# Altium schematic sheet Power_Stage.SchDoc
size A4; SheetNumber: 1; SheetTotal: 3
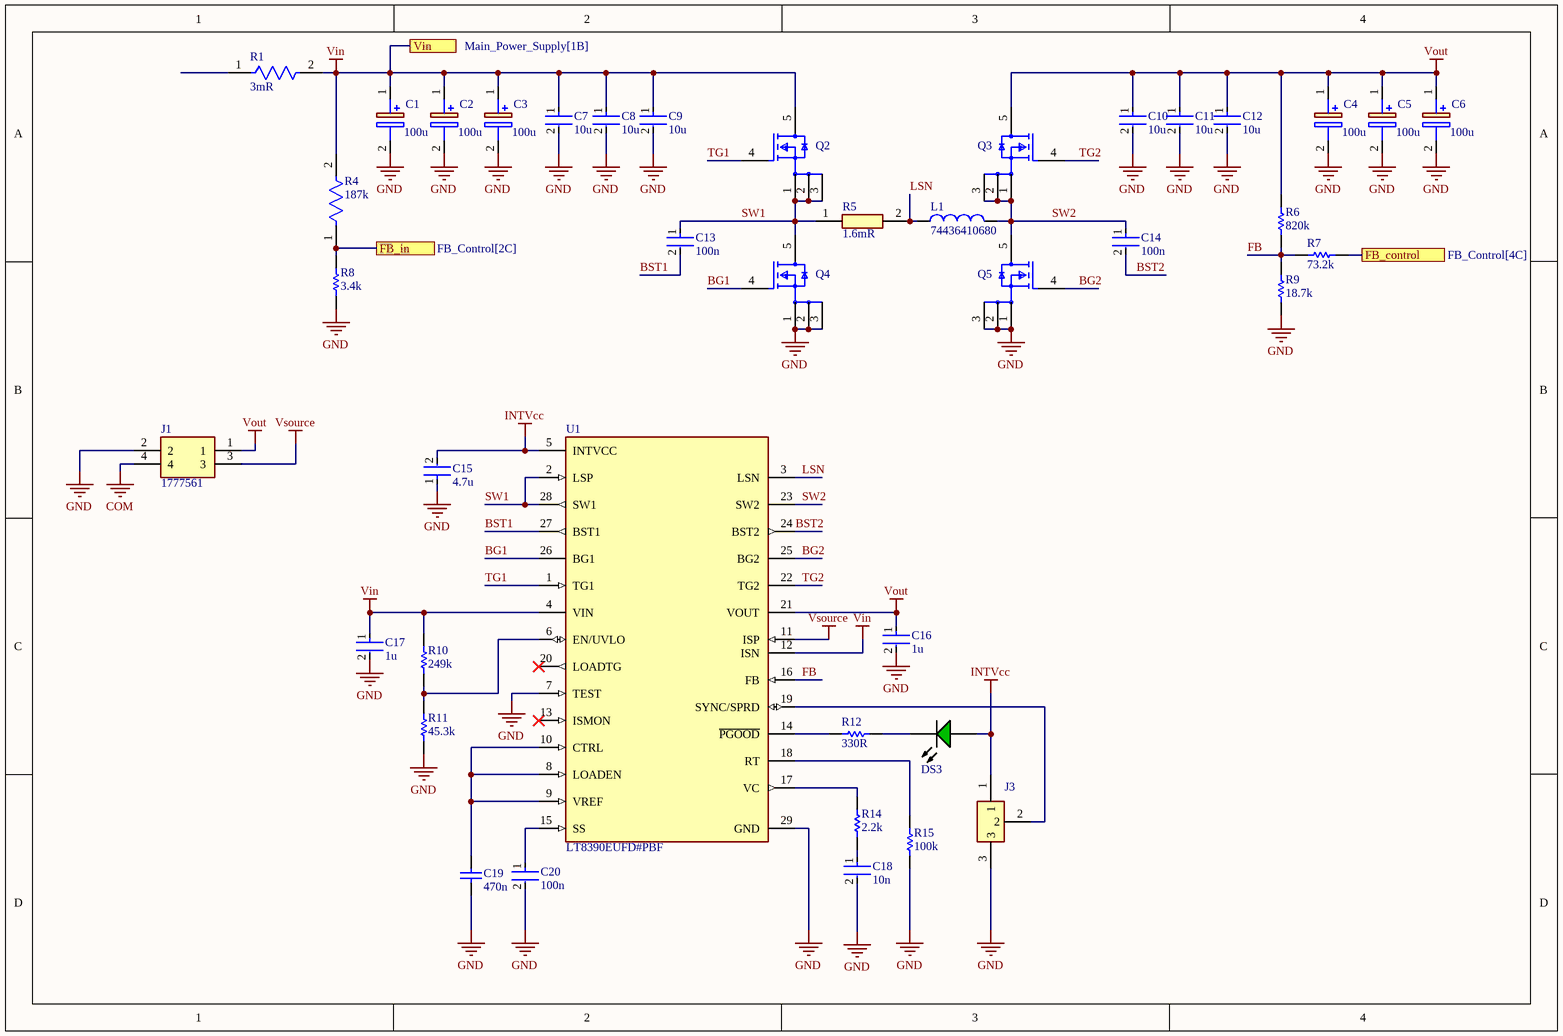
[diagram p0: Power_Stage.SchDoc]

## Parts
C1  value 100u  [CAPPRD500W65D1025H1700]  (hidden comment: ECA-2AM101B)
C2  value 100u  [CAPPRD500W65D1025H1700]  (hidden comment: ECA-2AM101B)
C3  value 100u  [CAPPRD500W65D1025H1700]  (hidden comment: ECA-2AM101B)
C4  value 100u  [CAPPRD500W65D1025H1700]  (hidden comment: ECA-2AM101B)
C5  value 100u  [CAPPRD500W65D1025H1700]  (hidden comment: ECA-2AM101B)
C6  value 100u  [CAPPRD500W65D1025H1700]  (hidden comment: ECA-2AM101B)
C7  10u  [FP-GRM32E-0_3-0_2-MFG]
C8  10u  [FP-GRM32E-0_3-0_2-MFG]
C9  10u  [FP-GRM32E-0_3-0_2-MFG]
C10  10u  [FP-GRM32E-0_3-0_2-MFG]
C11  10u  [FP-GRM32E-0_3-0_2-MFG]
C12  10u  [FP-GRM32E-0_3-0_2-MFG]
C13  100n  [FP-0805-L_2_01_0_2-W_1_25-MFG]
C14  100n  [FP-0805-L_2_01_0_2-W_1_25-MFG]
C15  4.7u  [FP-0805-L_2_01_0_2-W_1_25-IPC_A]
C16  1u  [FP-1210-L_3_3_0_4-W_2_5_0-IPC_C]
C17  1u  [FP-1210-L_3_3_0_4-W_2_5_0-IPC_C]
C18  10n  [FP-0805-L_2_01_0_2-W_1_25-IPC_B]
C19  470n  [CAPC2013X140X50ML20T25]
C20  100n  [FP-0805-L_2_01_0_2-W_1_25-MFG]
DS3  LTST-C170KGKT  [LTST-LTST-C170KGKT-2_V]  (value not drawn)
J1  1777561  [1777561]
J3  22-28-4030  [MOLEX_22-28-4030]  (value not drawn)
L1  74436410680  [WE-HCF_2815]
Q2  NVMYS3D3N06CLTWG  [FP-760AB-MFG]  (value not drawn)
Q3  NVMYS3D3N06CLTWG  [FP-760AB-MFG]  (value not drawn)
Q4  NVMYS3D3N06CLTWG  [FP-760AB-MFG]  (value not drawn)
Q5  NVMYS3D3N06CLTWG  [FP-760AB-MFG]  (value not drawn)
R1  3mR  [FP-CSS2H-3920K-3L00FE-MFG]
R4  187k  [FP-ERJ3EK-MFG]
R5  value 1.6mR  [RESC6432X89N]  (hidden comment: WSLP25121L600FEA)
R6  820k  [RESC1608X55X30ML15T15]
R7  73.2k  [RESC1005X40X25LL05T05]
R8  3.4k  [RESC1608X55X30LL15T15]
R9  18.7k  [RESC1608X55X30LL15T15]
R10  249k  [RESC1608X55X30ML15T15]
R11  45.3k  [RESC1608X55X30ML15T15]
R12  330R  [RESC1608X55X30LL15T15]
R14  2.2k  [RESC1608X55X30LL15T15]
R15  100k  [RESC1608X55X30ML15T15]
U1  LT8390EUFD#PBF  [FP-UFD-28-05-08-1712-MFG]

## Ports
FB_control (see FB_Control[4C]), FB_in (see FB_Control[2C]), Vin (see Main_Power_Supply[1B])

## Nets
COM: J1.4
GND: C1.2(-) C2.2(-) C3.2(-) C4.2(-) C5.2(-) C6.2(-) C7.2 C8.2 C9.2 C10.2 C11.2 C12.2 C15.1 C16.2 C17.2 C18.2 C19.1 C20.2 J1.2 J3.3 Q4.1(S) Q4.2(S) Q4.3(S) Q5.1(S) Q5.2(S) Q5.3(S) R8.1 R9.1 R11.1 R15.2 U1.7(TEST) U1.29(GND)
INTVcc: C15.2 DS3.2(A) J3.1 U1.5(INTVCC)
Vin: C1.1(+) C2.1(+) C3.1(+) C7.1 C8.1 C9.1 C17.1 Q2.5(D) R1.2 R4.2 R10.2 U1.4(VIN) U1.12(ISN) ; port Vin
Vout: C4.1(+) C5.1(+) C6.1(+) C10.1 C11.1 C12.1 C16.1 J1.1 Q3.5(D) R6.2 U1.21(VOUT)
Vsource: J1.3 U1.11(ISP)
BG1: Q4.4(G) U1.26(BG1)
BG2: Q5.4(G) U1.25(BG2)
BST1: C13.2 U1.27(BST1)
BST2: C14.2 U1.24(BST2)
FB: R6.1 R7.1 R9.2 U1.16(FB)
FB_control: R7.2 ; port FB_control
FB_in: R4.1 R8.2 ; port FB_in
LSN: L1.1 R5.2 U1.3(LSN)
SW1: C13.1 Q2.1(S) Q2.2(S) Q2.3(S) Q4.5(D) R5.1 U1.2(LSP) U1.28(SW1)
SW2: C14.1 L1.2 Q3.1(S) Q3.2(S) Q3.3(S) Q5.5(D) U1.23(SW2)
TG1: Q2.4(G) U1.1(TG1)
TG2: Q3.4(G) U1.22(TG2)
NetC18_1: C18.1 R14.1
NetC19_2: C19.2 U1.8(LOADEN) U1.9(VREF) U1.10(CTRL)
NetC20_1: C20.1 U1.15(SS)
NetDS3_1: DS3.1(K) R12.1
NetJ3_2: J3.2 U1.19(SYNC/SPRD)
NetR10_1: R10.1 R11.2 U1.6(EN/UVLO)
NetR12_2: R12.2 U1.14(~{PGOOD})
NetR14_2: R14.2 U1.17(VC)
NetR15_1: R15.1 U1.18(RT)

Not connected (* = marked no-connect by the designer): R1 1; U1 13(ISMON)* 20(LOADTG)*

## Library data of the parts
C1-C6 = ECA-2AM101B: Aluminium Electrolytic Capacitors 100uF 100V - Radial Leaded Al Lytic Cap 85C Radial M Series; Manufacturer_Name: Panasonic; Datasheet Link: http://industrial.panasonic.com/cdbs/www-data/pdf/RDF0000/ABA0000C1218.pdf; Height: 17mm; Manufacturer_Part_Number: ECA-2AM101B; Mouser Part Number: 667-ECA-2AM101B; Mouser Price/Stock: https://www.mouser.co.uk/ProductDetail/Panasonic/ECA-2AM101B?qs=ncxkyCpAYDDPznZ5ZfVZ2w%3D%3D; Arrow Part Number: ECA-2AM101B; Arrow Price/Stock: https://www.arrow.com/en/products/eca-2am101b/panasonic?region=nac
C7-C12 = CMP-06035-000081-2: Chip Multilayer Ceramic Capacitors for General Purpose, 1210, 10uF, X7S, 22%, 10%, 100V; Case Code (Metric): 3225; Case/Package: 1210; Case Code (Imperial): 1210; Voltage Rating: 100V; Capacitance: 10uF; Packaging: Tape and Reel; Mount: Surface Mount; Min Operating Temperature: -55°C; Max Operating Temperature: 125°C; Tolerance: 10%
C13 C14 C20 = CMP-2000-05808-2: General Purpose Ceramic Capacitor, 0805, 100nF, 5%, X7R, 0.15, 50V; Dissipation Factor: 2.5%; Insulation Resistance: 100GR; Length: 2.01mm; Min Operating Temperature: -55°C; Number of Pins: 2; Width: 0.049inch; Height: 0.94mm; Max Operating Temperature: 125°C; RoHS Compliant: Yes; Depth: 1.25mm; Radiation Hardening: No; Case Code (Metric): 2012; Case/Package: 0805; Contact Plating: Tin; Mount: Surface Mount; Tolerance: 5%; Dielectric Material: Ceramic; Case Code (Imperial): 0805; Capacitance: 100nF; Dielectric: X7R; Voltage Rating: 50V; REACH SVHC: No SVHC; Thickness: 0.037inch; Voltage Rating (DC): 50V; Lead Free: Lead Free; Package Quantity: 1; Packaging: Tape and Reel; Voltage: 50V; Termination: SMD/SMT
C15 = CMP-1036-04881-3: General Purpose Ceramic Capacitor, 0805, 4.7uF, 10%, X5R, 0.15, 10V; Min Operating Temperature: -55°C; RoHS Compliant: Yes; Dielectric: X5R; Lead Free: Lead Free; Radiation Hardening: No; Depth: 1.25mm; Case Code (Metric): 2012; Weight: 0.000194oz; Packaging: Tape and Reel; Voltage Rating: 10V; Capacitance: 4.7uF; Number of Pins: 2; Voltage: 10V; Construction: Flat; Length: 2.01mm; Case Code (Imperial): 0805; Package Quantity: 1; Voltage Rating (DC): 10V; Height: 1.4mm; Termination: SMD/SMT; Tolerance: 10%; REACH SVHC: No SVHC; Mount: Surface Mount; Width: 1.25mm; Max Operating Temperature: 85°C; Case/Package: 0805; Series: -; Thickness: 0.055inch
C16 C17 = CMP-2000-05475-2: General Purpose Ceramic Capacitor, 1210, 1uF, 10%, X7R, 15%, 100V; Tolerance: 20%; Dissipation Factor: 2.5%; Voltage Rating (DC): 100V; Series: -; Voltage Rating: 100V; Max Operating Temperature: 125°C; Radiation Hardening: No; Length: 3.2mm; Mount: Surface Mount; Termination: SMD/SMT; Voltage: 100V; RoHS Compliant: Yes; Case/Package: 1210; Thickness: 0.11inch; REACH SVHC: No SVHC; Lead Free: Lead Free; Height: 2.79mm; Case Code (Imperial): 1210; Contact Plating: Tin; Case Code (Metric): 3225; Min Operating Temperature: -55°C; Construction: Flat; Capacitance: 1uF; Depth: 2.5mm; Dielectric: X7R; Package Quantity: 1; Packaging: Tape and Reel; Width: 2.5mm
C18 = CMP-2007-04361-2: General Purpose Ceramic Capacitor, 0805, 10nF, 5%, X7R, 0.15, 50V; Insulation Resistance: 100GR; Dissipation Factor: 2.5%; Series: -; Case Code (Imperial): 0805; Voltage Rating (DC): 50V; Dielectric: X7R; Voltage Rating: 50V; Lead Free: Lead Free; Max Operating Temperature: 125°C; Depth: 1.25mm; Termination: SMD/SMT; Number of Pins: 2; Dielectric Material: Ceramic; Capacitance: 10nF; Case/Package: 0805; Contact Plating: Tin; Mount: Surface Mount; Height: 0.71mm; Package Quantity: 1; Packaging: Tape and Reel; Construction: Flat; RoHS Compliant: Yes; Voltage: 50V; Case Code (Metric): 2012; REACH SVHC: No SVHC; Tolerance: 5%; Radiation Hardening: No; Width: 0.049inch; Thickness: 0.037inch; Length: 2.01mm; Min Operating Temperature: -55°C
C19 = CMP-2007-04634-1: Manufacturer: AVX Interconnect / Elco; Part Number: 08055C474JAT2A
DS3 = CMP-2000-06620-1: Ultra Bright AlInGaP Chip LED, 75 mW, -55 to 85 degC, 2-Pin SMD (0805), RoHS, Tape and Reel; Manufacturer: Lite-On; Forward Current: 30mA; Power Dissipation Max: 75mW; Emitting Color: YellowGreen; Type: Uni-Color; Forward Voltage: 2.4V; Dominant Wave Length: 571nm; Test Current (It): 20mA; Product Length (mm): 2mm; Peak Wavelength: 574nm; Power Dissipation: 75W; Product Depth (mm): 1.25mm; DELETED: Compliant; High Brightness: Yes; Product Height (mm): 1.1mm; Luminous Intensity: 35mcd; Shape Type: Rectangular; Chip Material: AlGaInP; Viewing Angle: 130deg; Number of  Elements: 1; Reverse Voltage: 5V; Rad Hardened: No; Package Type: ChipLed; Manufacturer URL: http://www.us.liteon.com/; Mounting: SurfaceMount; Operating Temp Range: -55Cto85C; Datasheet URL: http://optoelectronics.liteon.com/upload/download/DS22-2000-073/S_110_LTST-C170KGKT.pdf; Packaging: TapeandReel; Pin Count: 2; Package Description: 2-Pin Surface Mounted Device, Body 2 x 1.25 mm; Mounting Technology: SurfaceMount; Package Reference: LTST-C170KGKT-2; Forward Current Max: 30mA; Datasheet Version: Rev. G, 06/2005; Lens Dimensions: 1.4x1.25x0.6mm; Operating Temperature Classification: Industrial; Lum Intensity: 35mcd; Main Category: ChipLED
J1 = 1777561: Connector; Manufacturer_Name: Phoenix Contact; Datasheet Link: https://www.digikey.com/en/products/detail/phoenix-contact/1777561/4453071?s=N4IgTCBcDaIIwHYkFYBscQF0C%2BQ; Height: 27.2mm; Manufacturer_Part_Number: 1777561; Mouser Part Number: 651-1777561; Mouser Price/Stock: https://www.mouser.co.uk/ProductDetail/Phoenix-Contact/1777561?qs=eS454NpRRZHLxN8tVDEUWQ%3D%3D; Arrow Part Number: 1777561; Arrow Price/Stock: https://www.arrow.com/en/products/1777561/phoenix-contact?region=nac
J3 = 22-28-4030: Connector Header Through Hole 3 position 0.100" (2.54mm); Package: None; Price: None; Value: *; MP: 22-28-4030; Availability: Unavailable
L1 = CMP-03913-84285494-2: 74436410680 Inductor, high current, 6.8uH, 1.44mOhm, 27mmL x 28mmW x 15.4mmH, SMT; Inductance: 6.8µH; Saturation Current: 30A; DC Resistance (DCR): 1.31mΩ; Inductance Tolerance: 15%; Ambient Temperature Range High: 75°C; Length: 27mm; NexarPartId: 84285494; Height: 15.4mm; Min Operating Temperature: -40°C; Ambient Temperature Range Low: -40°C; Max Operating Temperature: 125°C; Number of Pins: 2; RoHS: Compliant; Width: 28mm
Q2-Q5 = CMP-00278-99684032-1: NVMYS3D3N06CLTWG Single Mosfet Transistors Rohs Compliant: Yes; Manufacturer Lifecycle Status: ACTIVE; Turn-On Delay Time: 15ns; Drain to Source Resistance: 2.6mΩ; Gate to Source Voltage (Vgs): 20V; Number of Channels: 1; Max Junction Temperature (Tj): 175°C; Drain to Source Breakdown Voltage: 60V; Turn-Off Delay Time: 66ns; Continuous Drain Current (ID): 26A; Power Dissipation: 3.9W; NexarPartId: 99684032; Min Operating Temperature: -55°C; RoHS: Compliant; Drain to Source Voltage (Vdss): 60V; Lifecycle Status: Production; Max Operating Temperature: 175°C; Height: 1.3mm
R1 = CMP-07231-007409-1: RES 0.003 OHM 1% 5W 3920; Temperature Coefficient: 50ppm/°C; Max Power Dissipation: 5W; Resistor Type: Metal Element; RoHS Compliant: Yes; Case/Package: 3920; Tolerance: 1%; Packaging: Tape and Reel; Features: Moisture Resistant; Series: CSS2H-3920; Resistance: 3mR; Min Operating Temperature: -55°C; Number of Terminations: 2; Max Operating Temperature: 170°C
R4 = CMP-2000-00305-2: RES SMD 187K OHM 1% 1/10W 0603; Temperature Coefficient: 100ppm/°C; Max Power Dissipation: 100mW; Voltage Rating (DC): 50V; Resistance: 187kR; Voltage Rating: 75V; Packaging: Tape and Reel; Height: 0.45mm; Mount: Surface Mount; Min Operating Temperature: -55°C; Contact Plating: Tin; Radiation Hardening: No; Case/Package: 0603; Technology: THICK FILM; Resistor Type: Thick Film; Features: Automotive AEC-Q200; Length: 1.6mm; REACH SVHC: Yes; Construction: Rectangular; Max Operating Temperature: 155°C; Military Standard: Not; Case Code (Imperial): 0603; RoHS Compliant: Yes; Package Quantity: 1; Power Rating: 100mW; Termination: SMD/SMT; Resistance Tolerance: 1%; Number of Terminations: 2; Case Code (Metric): 1608; Depth: 0.8mm; Series: ERJ; Tolerance: 1%; Width: 0.8mm; Lead Free: Lead Free
R5 = WSLP25121L600FEA: Current Sense Resistors - SMD 3watt .0016ohm 1%; Manufacturer_Name: Vishay; Datasheet Link: https://www.vishay.com/docs/30122/wslp.pdf; Height: 0.889mm; Manufacturer_Part_Number: WSLP25121L600FEA
R6 = CMP-2000-00657-1: Manufacturer: Panasonic; Part Number: ERJ3EKF8203V
R7 = CMP-2002-01054-1: Part Number: ERJ-2RKF7322X; Manufacturer: Panasonic
R8 = CMP-2000-00446-1: Part Number: ERJ-3EKF3401V; Manufacturer: Panasonic
R9 = CMP-2000-00304-1: Part Number: ERJ-3EKF1872V; Manufacturer: Panasonic
R10 = CMP-2000-00371-1: Part Number: ERJ-3EKF2493V; Manufacturer: Panasonic
R11 = CMP-1012-00697-2: Manufacturer: Panasonic; Part Number: ERJ-3EKF4532V
R12 = CMP-2000-00435-2: Chip Resistor, 330 Ohm, +/- 1%, 0.1 W, -55 to 155 degC, 0603 (1608 Metric), RoHS, Tape and Reel; Gender: Male; Mating Cycles: 10000; Current Rating: 500 mA; Voltage Rating: 10 V; REACH SVHC: No SVHC; PackageDescription: 2-Pin Surface Mount Device, Body 1.6 x 0.85 mm; Contact Finish: Gold; Pins: 8; ComponentLink1Description: Manufacturer URL; Packaging: Tape and Reel; Max Operating Temperature: 85 degC; Contact Material: Copper; Height: 1.45 mm; Width: 1.45 mm; DatasheetVersion: Apr-15; Package Quantity: 1500; Contact Plating: Gold; PackageReference: 0603; Mount: Surface Mount; Lead Pitch: 1.1 mm; Min Operating Temperature: -25 degC; ComponentLink1URL: http://www.panasonic.com/; ComponentLink2URL: http://industrial.panasonic.com/cdbs/www-data/pdf/RDA0000/AOA0000C86.pdf; Length: 13.7 mm; ComponentLink2Description: Datasheet; RoHSCompliant: true
R14 = CMP-2000-00336-1: Part Number: ERJ3EKF2201V; Manufacturer: Panasonic
R15 = CMP-2000-00182-1: Part Number: ERJ-3EKF1003V; Manufacturer: Panasonic
U1 = CMP-09139-000027-1: IC REG CTRLR BUCK/BOOST 28QFN; Number of Output Phases: 1; Max Supply Voltage: 60V; Min Supply Voltage: 4V; Switching Frequency: 630kHz; Synchronous Rectifier: Yes; Topology: Buck-Boost; Max Duty Cycle: 95%; Output Configuration: Positive; Case/Package: QFN; Min Operating Temperature: -40°C; REACH SVHC: No SVHC; Number of Pins: 28; Max Operating Temperature: 125°C; Clock Sync: Yes; Number of Outputs: 1